# Altium schematic sheet USB_OTG.SchDoc: USB_OTG_HS
size A4; DocumentNumber: MB1246; Revision: B.1; SheetNumber: 8; SheetTotal: 17; Project: STM32H7xxI-EVAL
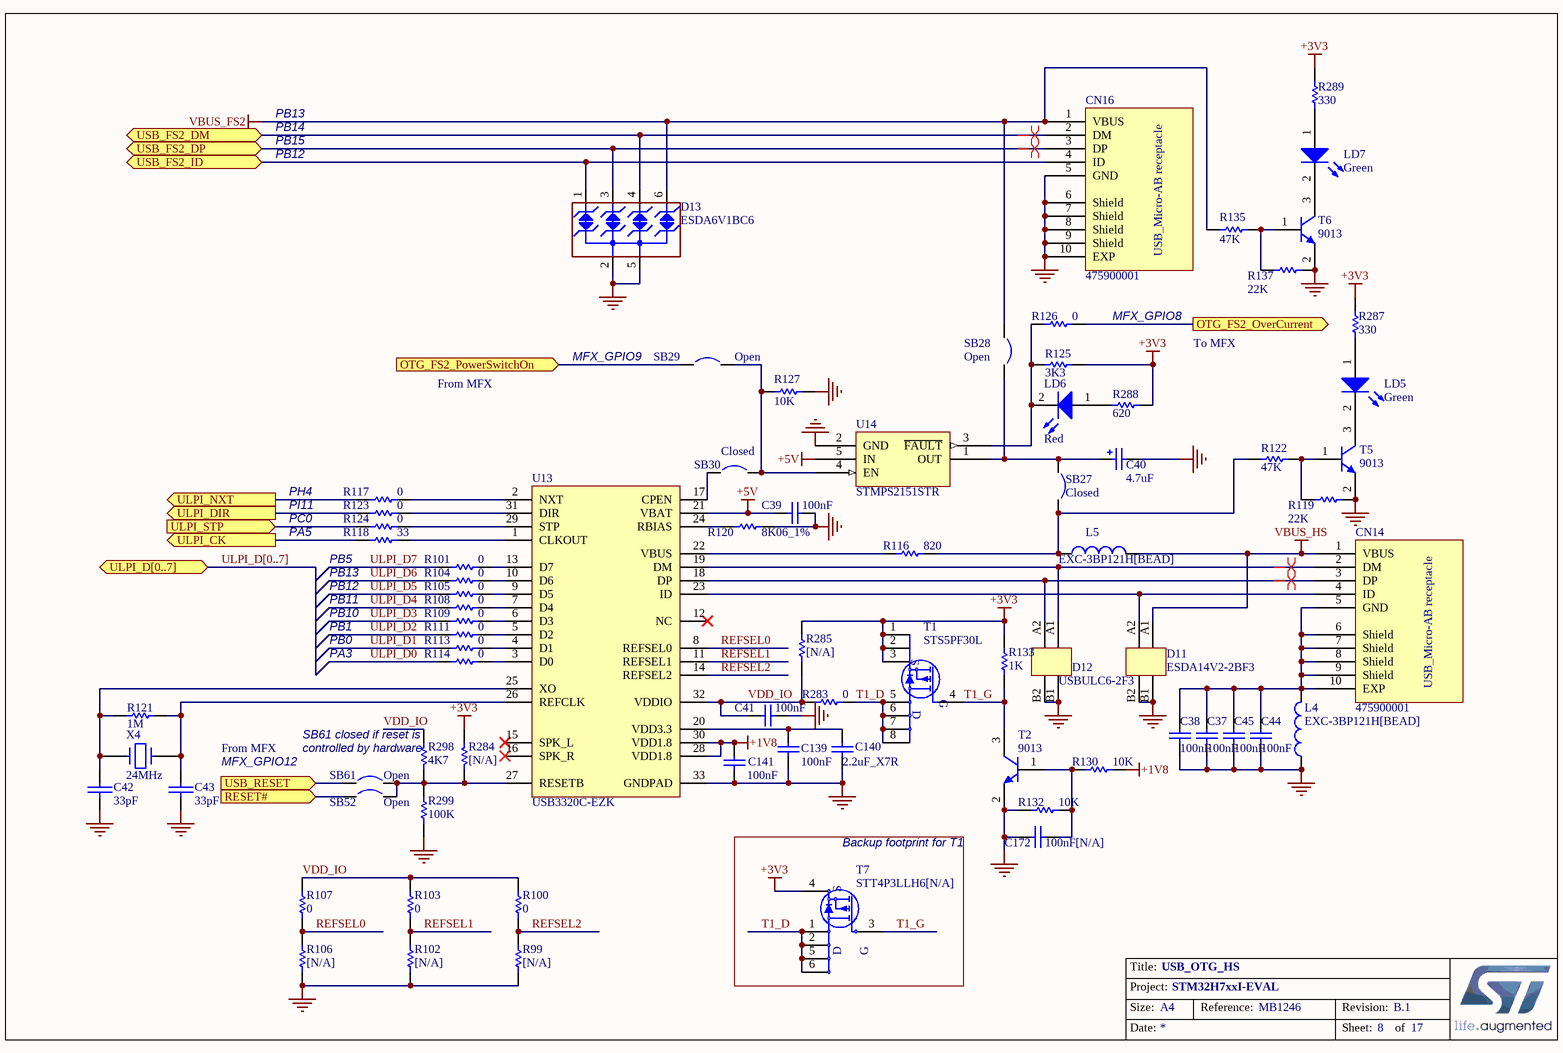
[diagram p0: USB_OTG.SchDoc]

## Parts
C37  100nF  [0603C]
C38  100nF  [0603C]
C39  100nF  [0603C]
C40  4.7uF  [TAN-A]
C41  100nF  [0603C]
C42  33pF  [0603C]
C43  33pF  [0603C]
C44  100nF  [0603C]
C45  100nF  [0603C]
C139  100nF  [0603C]
C140  2.2uF_X7R  [0603C]
C141  100nF  [0603C]
C172  100nF[N/A]  [0603C]
CN14  475900001  [MOLEX_47590001]
CN16  475900001  [MOLEX_47590001]
D11  ESDA14V2-2BF3  [BGA4_0R4_0R8X0R8]
D12  USBULC6-2F3  [BGA4_0R4_1X1]
D13  ESDA6V1BC6  [SOT23-6L]
L4  EXC-3BP121H[BEAD]  [0603L]
L5  EXC-3BP121H[BEAD]  [0603L]
LD5  Green  [0603D]
LD6  Red  [0603D]
LD7  Green  [0603D]
R99  [N/A]  [0603R]
R100  0  [0603R]
R101  0  [0603R]
R102  [N/A]  [0603R]
R103  0  [0603R]
R104  0  [0603R]
R105  0  [0603R]
R106  [N/A]  [0603R]
R107  0  [0603R]
R108  0  [0603R]
R109  0  [0603R]
R111  0  [0603R]
R113  0  [0603R]
R114  0  [0603R]
R116  820  [0603R]
R117  0  [0603R]
R118  33  [0603R]
R119  22K  [0603R]
R120  8K06_1%  [0603R]
R121  1M  [0603R]
R122  47K  [0603R]
R123  0  [0603R]
R124  0  [0603R]
R125  3K3  [0603R]
R126  0  [0603R]
R127  10K  [0603R]
R130  10K  [0603R]
R132  10K  [0603R]
R133  1K  [0603R]
R135  47K  [0603R]
R137  22K  [0603R]
R283  0  [0603R]
R284  [N/A]  [0603R]
R285  [N/A]  [0603R]
R287  330  [0603R]
R288  620  [0603R]
R289  330  [0603R]
R298  4K7  [0603R]
R299  100K  [0603R]
SB27  Closed  [SB_0603]
SB28  Open  [SB_0603]
SB29  Open  [SB_0603]
SB30  Closed  [SB_0603]
SB52  Open  [SB_0603]
SB61  Open  [SB_0603]
T1  STS5PF30L  [SOIC8_1R27_4R9X6]
T2  9013  [SOT-23]
T5  9013  [SOT-23]
T6  9013  [SOT-23]
T7  STT4P3LLH6[N/A]  [SOT23-6L]
U13  USB3320C-EZK  [QFN32_0R5_5X5]
U14  STMPS2151STR  [SOT23-5]
X4  24MHz  [XTAL1]

## Blocks framed on the sheet
Backup footprint for T1: T7

## Ports
OTG_FS2_OverCurrent (out), OTG_FS2_PowerSwitchOn (in), RESET# (in), ULPI_CK (out), ULPI_D[0..7] (bidir), ULPI_DIR (out), ULPI_NXT (out), ULPI_STP (in), USB_FS2_DM (bidir), USB_FS2_DP (bidir), USB_FS2_ID (bidir), USB_RESET (in)

## Nets
+1V8: C141.1 R130.1 U13.28(VDD1.8) U13.30(VDD1.8)
+3V3: R125.1 R133.2 R284.2 R285.1 R287.2 R288.2 R289.2 T1.1(S) T1.2(S) T1.3(S) T7.4(S)
+5V: C39.1 U13.21(VBAT) U14.5(IN)
GND: C37.2 C38.2 C39.2 C40.2 C41.2 C42.2 C43.2 C44.2 C45.2 C139.2 C140.1 C141.2 C172.2 CN16.5(GND) CN16.6(Shield) CN16.7(Shield) CN16.8(Shield) CN16.9(Shield) CN16.10(EXP) D11.B1 D11.B2 D12.B1 D12.B2 D13.2(IO2) D13.5(IO4) L4.1 R99.1 R102.1 R106.1 R119.1 R120.2 R127.1 R132.2 R137.1 R299.1 T2.2(E) T5.2(E) T6.2(E) U13.33(GNDPAD) U14.2(GND)
VBUS_FS2: CN16.1(VBUS) D13.6(NC) R135.1 SB28.1
VBUS_HS: CN14.1(VBUS) D11.A1 L5.2
OTG_FS2_OverCurrent: R126.1 ; port OTG_FS2_OverCurrent
OTG_FS2_PowerSwitchOn: SB29.1 ; port OTG_FS2_PowerSwitchOn
REFSEL0: R106.2 R107.1 U13.8(REFSEL0)
REFSEL1: R102.2 R103.1 U13.11(REFSEL1)
REFSEL2: R99.2 R100.1 U13.14(REFSEL2)
RESET#: SB52.1 ; port RESET#
T1_D: R283.1 T1.5(D) T1.6(D) T1.7(D) T1.8(D) T7.1(S) T7.2(S) T7.5(D) T7.6(D)
T1_G: R133.1 T1.4(G) T2.3(C) T7.3(G)
ULPI_CK: R118.2 ; port ULPI_CK
ULPI_D0: R114.2
ULPI_D1: R113.2
ULPI_D2: R111.2
ULPI_D3: R109.2
ULPI_D4: R108.2
ULPI_D5: R105.2
ULPI_D6: R104.2
ULPI_D7: R101.2
ULPI_DIR: R123.2 ; port ULPI_DIR
ULPI_NXT: R117.2 ; port ULPI_NXT
ULPI_STP: R124.2 ; port ULPI_STP
USB_FS2_DM: CN16.2(DM) D13.4(IO3) ; port USB_FS2_DM
USB_FS2_DP: CN16.3(DP) D13.3(GND) ; port USB_FS2_DP
USB_FS2_ID: CN16.4(ID) D13.1(IO1) ; port USB_FS2_ID
USB_RESET: SB61.1 ; port USB_RESET
VDD_IO: C41.1 R100.2 R103.2 R107.2 R283.2 R285.2 R298.2 U13.32(VDDIO)
NetC37_1: C37.1 C38.1 C44.1 C45.1 CN14.5(GND) CN14.6(Shield) CN14.7(Shield) CN14.8(Shield) CN14.9(Shield) CN14.10(EXP) L4.2
NetC40_1: C40.1 SB27.1 SB28.2 U14.1(OUT)
NetC42_1: C42.1 R121.1 U13.25(XO) X4.2
NetC43_1: C43.1 R121.2 U13.26(REFCLK) X4.1
NetC139_1: C139.1 C140.2 U13.20(VDD3.3)
NetC172_1: C172.1 R130.2 R132.1 T2.1(B)
NetCN14_2: CN14.2(DM) D12.A1 U13.19(DM)
NetCN14_3: CN14.3(DP) D12.A2 U13.18(DP)
NetCN14_4: CN14.4(ID) D11.A2 U13.23(ID)
NetL5_1: L5.1 R116.2 R122.2 SB27.2
NetLD5_1: LD5.1(A) R287.1
NetLD5_2: LD5.2(K) T5.3(C)
NetLD6_1: LD6.1(A) R288.1
NetLD6_2: LD6.2(K) R125.2 R126.2 U14.3(~{FAULT})
NetLD7_1: LD7.1(A) R289.1
NetLD7_2: LD7.2(K) T6.3(C)
NetR101_1: R101.1 U13.13(D7)
NetR104_1: R104.1 U13.10(D6)
NetR105_1: R105.1 U13.9(D5)
NetR108_1: R108.1 U13.7(D4)
NetR109_1: R109.1 U13.6(D3)
NetR111_1: R111.1 U13.5(D2)
NetR113_1: R113.1 U13.4(D1)
NetR114_1: R114.1 U13.3(D0)
NetR116_1: R116.1 U13.22(VBUS)
NetR117_1: R117.1 U13.2(NXT)
NetR118_1: R118.1 U13.1(CLKOUT)
NetR119_2: R119.2 R122.1 T5.1(B)
NetR120_1: R120.1 U13.24(RBIAS)
NetR123_1: R123.1 U13.31(DIR)
NetR124_1: R124.1 U13.29(STP)
NetR127_2: R127.2 SB29.2 SB30.2 U14.4(EN)
NetR135_2: R135.2 R137.2 T6.1(B)
NetR284_1: R284.1 R298.1 R299.2 SB52.2 SB61.2 U13.27(RESETB)
NetSB30_1: SB30.1 U13.17(CPEN)

Not connected (* = marked no-connect by the designer): U13 12(NC)* 15(SPK_L)* 16(SPK_R)*

## Buses and harness runs
bus ULPI_D[0..7] = port ULPI_D[0..7]

## Layout directives
differential pair: NetCN14_2, NetCN14_3, USB_FS2_DM, USB_FS2_DP

## Notes on the sheet
- PB13
- PB12
- PB14
- PB15
- MFX_GPIO8
- From MFX
- MFX_GPIO9
- To MFX
- PH4
- PI11
- PC0
- PA5
- PB5
- PA3
- PB0
- PB1
- PB10
- PB11
- MFX_GPIO12
- (near R298) SB61 closed if reset is
- (near R298) controlled by hardware
- Title:
- Project:
- Size:
- Date:
- A4
- Reference:
- Sheet:
- Revision:
- of
- (in symbol 475900001) USB_Micro-AB receptacle

## Library data of the parts
C37-C39 C41 C44 C45 C139-C141 = Cap: Capacitor; Value: 10nF; Published: 8-Jun-2000; Revision: July-2002: Re-released for DXP Platform.; Publisher: Altium Limited
C40 = Cap Pol1: Polarized Capacitor (Radial); Value: 47uF; Published: 8-Jun-2000; Revision: July-2002: Re-released for DXP Platform.; Publisher: Altium Limited
C42 C43 = CAP: Capacitor
C172 = Cap_100nF_X7R_10%_0402: Capacitor,100nF,16V,X7R,10%,0402,YAGEO; Manuf_Part_1: CC0402KRX7R7BB104; Revision: July-2002: Re-released for DXP Platform.; Value: 100nF; Order: CC0402KRX7R7BB104; Manuf_1: YAGEO
D13 = ESDA6V1BC6: 4-line ESD protection; Manuf_1: STM; Manuf_Part_1: ESDA5V3L; Description: Dual Transil array for ESD protection; Ref St: 9179034; Provided: ST; ECCN_US/EU: EAR99/NEC; Distrib: ST; Order: ESDA5V3L; Ordered by: STM
L4 L5 = Inductor: Value: 100uH; Published: 8-Jun-2000; Revision: July-2002: Re-released for DXP Platform.; Publisher: Altium Limited
LD5-LD7 = LED2: Typical RED, GREEN, YELLOW, AMBER GaAs LED; Published: 8-Jun-2000; Revision: July-2002: Re-released for DXP Platform.; Publisher: Altium Limited
R99-R109 R111 R113 R114 R117 R118 R121 R123 R124 R126 R283-R285 R288 R298 = Res1: Resistor; Value: 1K; Published: 8-Jun-2000; Revision: July-2002: Re-released for DXP Platform.; Publisher: Altium Limited
R116 R119 R122 R125 R127 R130 R132 R135 R137 R287 R289 = res1: Resistor; Value: 1K; Published: 8-Jun-2000; Revision: July-2002: Re-released for DXP Platform.; Publisher: Altium Limited
R120 = Res_8K06_1%_0402: Resistor,8K06,0402,1%,YAGEO; Manuf_Part_1: RC0402FR-078K06L; Value: 8K06; Manuf_1: YAGEO; Order: RC0402FR-078K06L; ECCN_US/EU: n/a; Distrib: DIGIKEY
R133 = res1: Resistor; Published: 8-Jun-2000; Revision: July-2002: Re-released for DXP Platform.; Publisher: Altium Limited; Value: 1K
R299 = Resistor_ST: Resistor 0402 / 0603 / 0805; Description: Resistor 0402 or 0603 or 0805; Value: 10K
SB27 SB30 = Circuit Breaker_close: Circuit Breaker; Published: 24-Mar-1999; Revision: July-2002: Re-released for DXP Platform.; Publisher: Altium Limited
SB28 SB29 SB52 SB61 = Circuit Breaker: Published: 24-Mar-1999; Revision: July-2002: Re-released for DXP Platform.; Publisher: Altium Limited
T1 = STS7PF30L
T2 T5 T6 = NPN: NPN Bipolar Transistor; Code - JEDEC: TO-226-AA; Published: 8-Jun-2000; Revision: July-2002: Re-released for DXP Platform.; Publisher: Altium Limited
T7 = STT7P2UH7: STripFET VII DeepGATE Power MOSFET, P-CHANNEL 20 V, 0.0146, 7 A - SOT23-6L; Manuf_1: STM; Provided: ST; Ref St: xxxxxxxx; ECCN_US/EU: EAR99/NEC; Comments: exclusive with T4; Manuf_Part_1: STT7P2UH7; Order: STT7P2UH7; Distrib: ST; Ordered by: STM
U13 = USB3320C-EZK: USB3320C,  Hi-Speed USB Host, Device or OTG PHY with ULPI Low Pin Interface; Manuf_1: MICROCHIP; Manuf_Part_1: USB3320C-EZK-TR; Description: USB3320C, Hi-Speed USB Host, Device or OTG PHY with ULPI Low Pin Interface; Distrib: MICROCHIP; Order: USB3320C-EZK-TR; ECCN_US/EU: *
U14 = STMPS2141STR
X4 = CRYSTAL